# EAGLE design Lügendetektor (EAGLE 4.16)
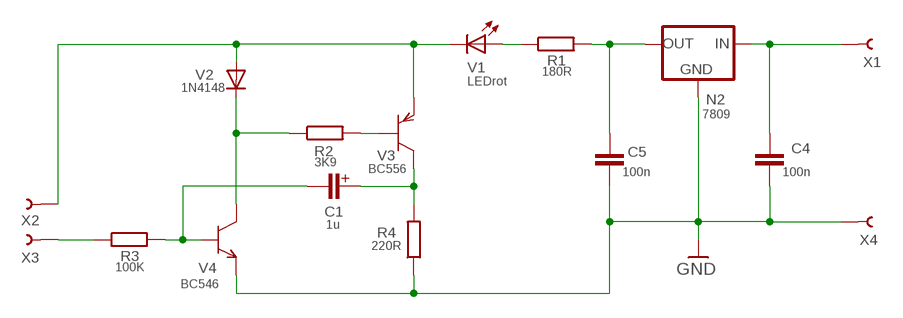
[diagram p0: schematic, sheet 1]

## Parts
C1  1u  CPOL-EUE2-5  [E2-5]
C4  100n  C-EUC05-024X044  [C050-024X044]
C5  100n  C-EUC05-024X044  [C050-024X044]
N2  7809  78XXSTEH  [78XXSTEH]
R1  180R  R-EU_0207/10  [0207/10]
R2  3K9  R-EU_0207/10  [0207/10]
R3  100K  R-EU_0207/10  [0207/10]
R4  220R  R-EU_0207/10  [0207/10]
V1  LEDrot  LED5MM  [LED5]
V2  1N4148  DIODE7_5  [D7_5]
V3  BC556  PNPBC556  [TO92IL]
V4  BC546  NPN_EBCBC546  [TO92IL]
X1  LSP1  [LSP1]
X2  LSP1  [LSP1]
X3  LSP1  [LSP1]
X4  LSP1  [LSP1]

## Nets
GND: C4.2 C5.2 N2.GND R4.1 V4.E X4.1
N$1: R3.1 X3.1
N$2: C5.1 N2.OUT R1.2
N$4: C1.+ R4.2 V3.C
N$5: C1.- R3.2 V4.B
N$6: R2.1 V2.C V4.C
N$7: R2.2 V3.B
N$8: V1.K(C) V2.A V3.E X2.1
N$9: R1.1 V1.A
N$11: C4.1 N2.IN X1.1

## Library data of the parts
C1 = mylib:CPOL-EU: POLARIZED CAPACITOR, European symbol
C4 C5 = mylib:C-EU
N2 = mylib:78XX
R1-R4 = mylib:R-EU_: RESISTOR, European symbol
V1 = mylib:LED
V2 = mylib:DIODE
V3 = mylib:PNP
V4 = mylib:NPN_EBC
X1-X4 = mylib:LSP1

## Board
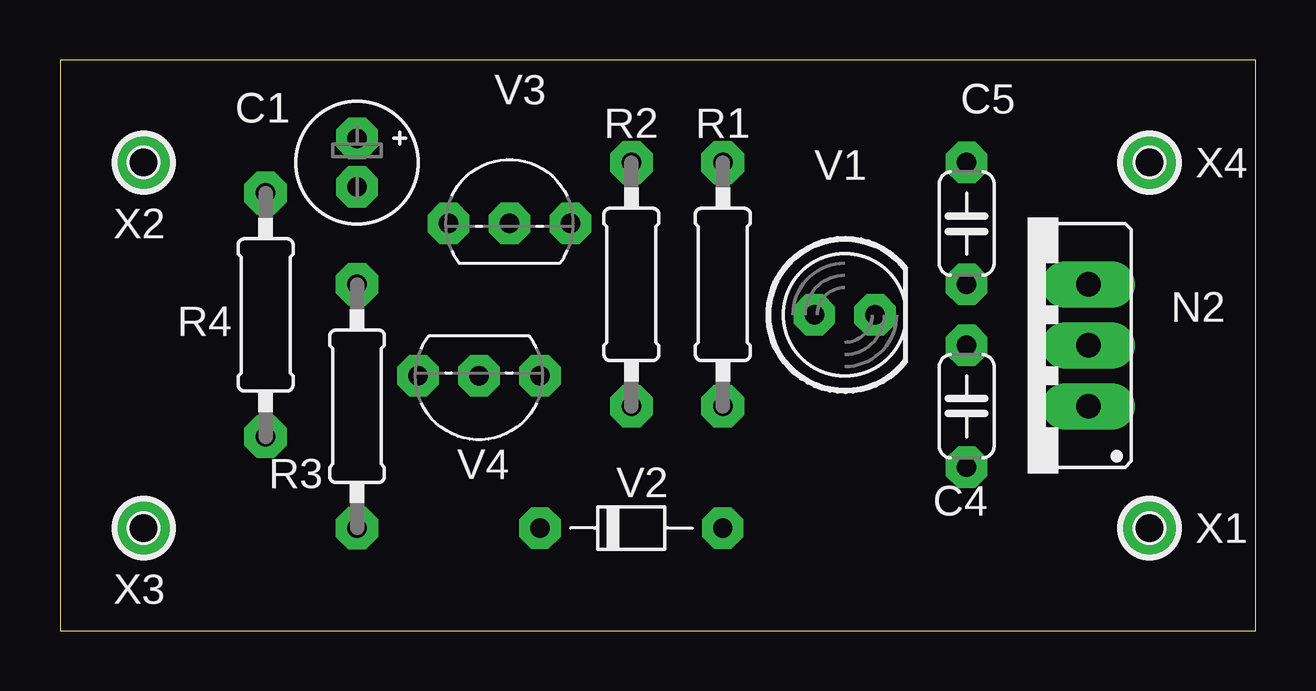
[diagram p1: board, top side]
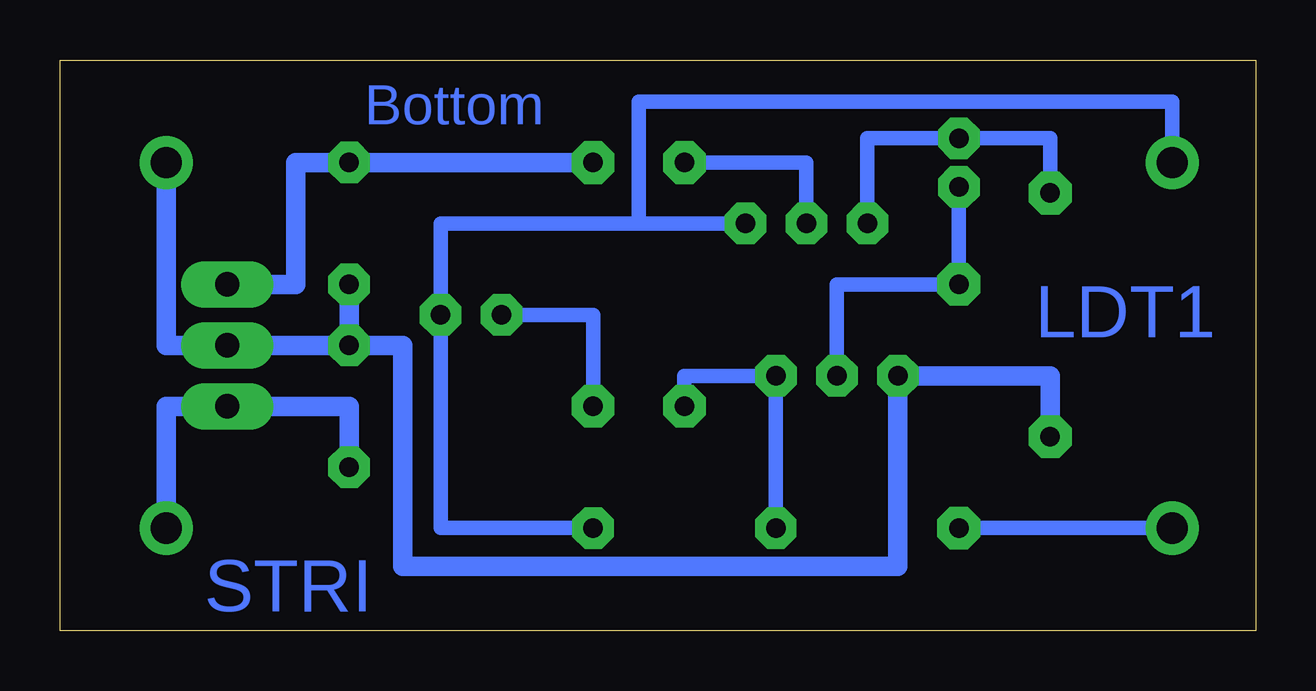
[diagram p2: board, bottom side, seen from below]

Size 49.83 x 23.8 mm. Coordinates in mm from the lower left corner, seen from the top.
Outline: 0,0 49.83,0 49.83,23.8 0,23.8 0,0
Copper layers (1+16): Top 0.035mm / dielectric 1.5mm / Bottom 0.035mm
Design rules "2HN": minimum track width 16mil, minimum drill 0.6mm, track to track 10mil, track to pad 8mil, pad to pad 8mil, via to via 8mil, smd to smd 8mil, copper to edge 20mil, drill to drill 8mil, minimum pad ring 18mil, minimum via ring 15mil, stop-mask expansion 4mil, vias tented up to drill 0mil, thermal gap 40mil

### Footprints (pad centres in the part's own frame; a part is rotated, then mirrored left to right if it is on the bottom)
E2-5 = drill 0.813 pad 1.27 octagon: + -1.016,0; - 1.016,0
C050-024X044 = drill 0.813 octagon: 1 -2.54,0; 2 2.54,0
78XXSTEH = drill 1.016 pad 1.676 long: GND 0,-2.54; IN -2.54,-2.54; OUT 2.54,-2.54
0207/10 = drill 0.813 pad 1.778 octagon: 1 -5.08,0; 2 5.08,0
LED5 = drill 0.813 pad 1.676 octagon: A -1.27,0; K 1.27,0
D7_5 = drill 0.8 octagon: A 3.81,0; C -3.81,0
TO92IL = drill 0.813 octagon: B 0,0; C -2.54,0; E 2.54,0
LSP1 = drill 1.3 round: 1 0,0

### Placement (x,y rotation side)
C1  12.38,19.52 270 top
C4  37.78,9.36 90 top
C5  37.78,16.98 270 top
N2  40.32,11.9 90 top
R1  27.62,14.44 90 top
R2  23.81,14.44 90 top
R3  12.38,9.36 90 top
R4  8.57,13.17 90 top
V1  32.7,13.17 0 top
V2  23.81,4.28 0 top
V3  18.73,16.98 0 top
V4  17.46,10.63 180 top
X1  45.4,4.28 0 top
X2  3.49,19.52 0 top
X3  3.49,4.28 0 top
X4  45.4,19.52 0 top

### Tracks (layer width: path | path; a pad name or v marks a point on that pad's centre or on a via)
GND
  Bottom 0.813: R4.1 8.57,10.63 V4.E 14.92,2.69 35.56,2.69 35.56,11.9 C4.2 | C4.2 C5.2 | C4.2 N2.GND 45.4,11.9 X4.1
N$1
  Bottom 0.61: R3.1 X3.1
N$2
  Bottom 0.813: R1.2 C5.1 40,19.52 40,14.44 N2.OUT
N$4
  Bottom 0.61: R4.2 8.57,20.54 C1.+ 16.19,20.54 V3.C
N$5
  Bottom 0.61: V4.B 17.46,14.44 R3.2 C1.-
N$6
  Bottom 0.61: R2.1 23.81,10.63 V4.C V2.C
N$7
  Bottom 0.61: V3.B 18.73,19.52 R2.2
N$8
  Bottom 0.61: 25.71,16.98 V3.E | 25.71,16.98 33.97,16.98 V1.K 33.97,4.28 V2.A | X2.1 3.49,22.06 25.71,22.06 25.71,16.98
N$9
  Bottom 0.61: R1.1 27.62,13.17 V1.A
N$11
  Bottom 0.813: X1.1 45.4,9.36 N2.IN 37.78,9.36 C4.1

### Text on the board
Bottom: Bottom | LDT1 | STRI